# EAGLE design RCPCell (EAGLE 5.12)
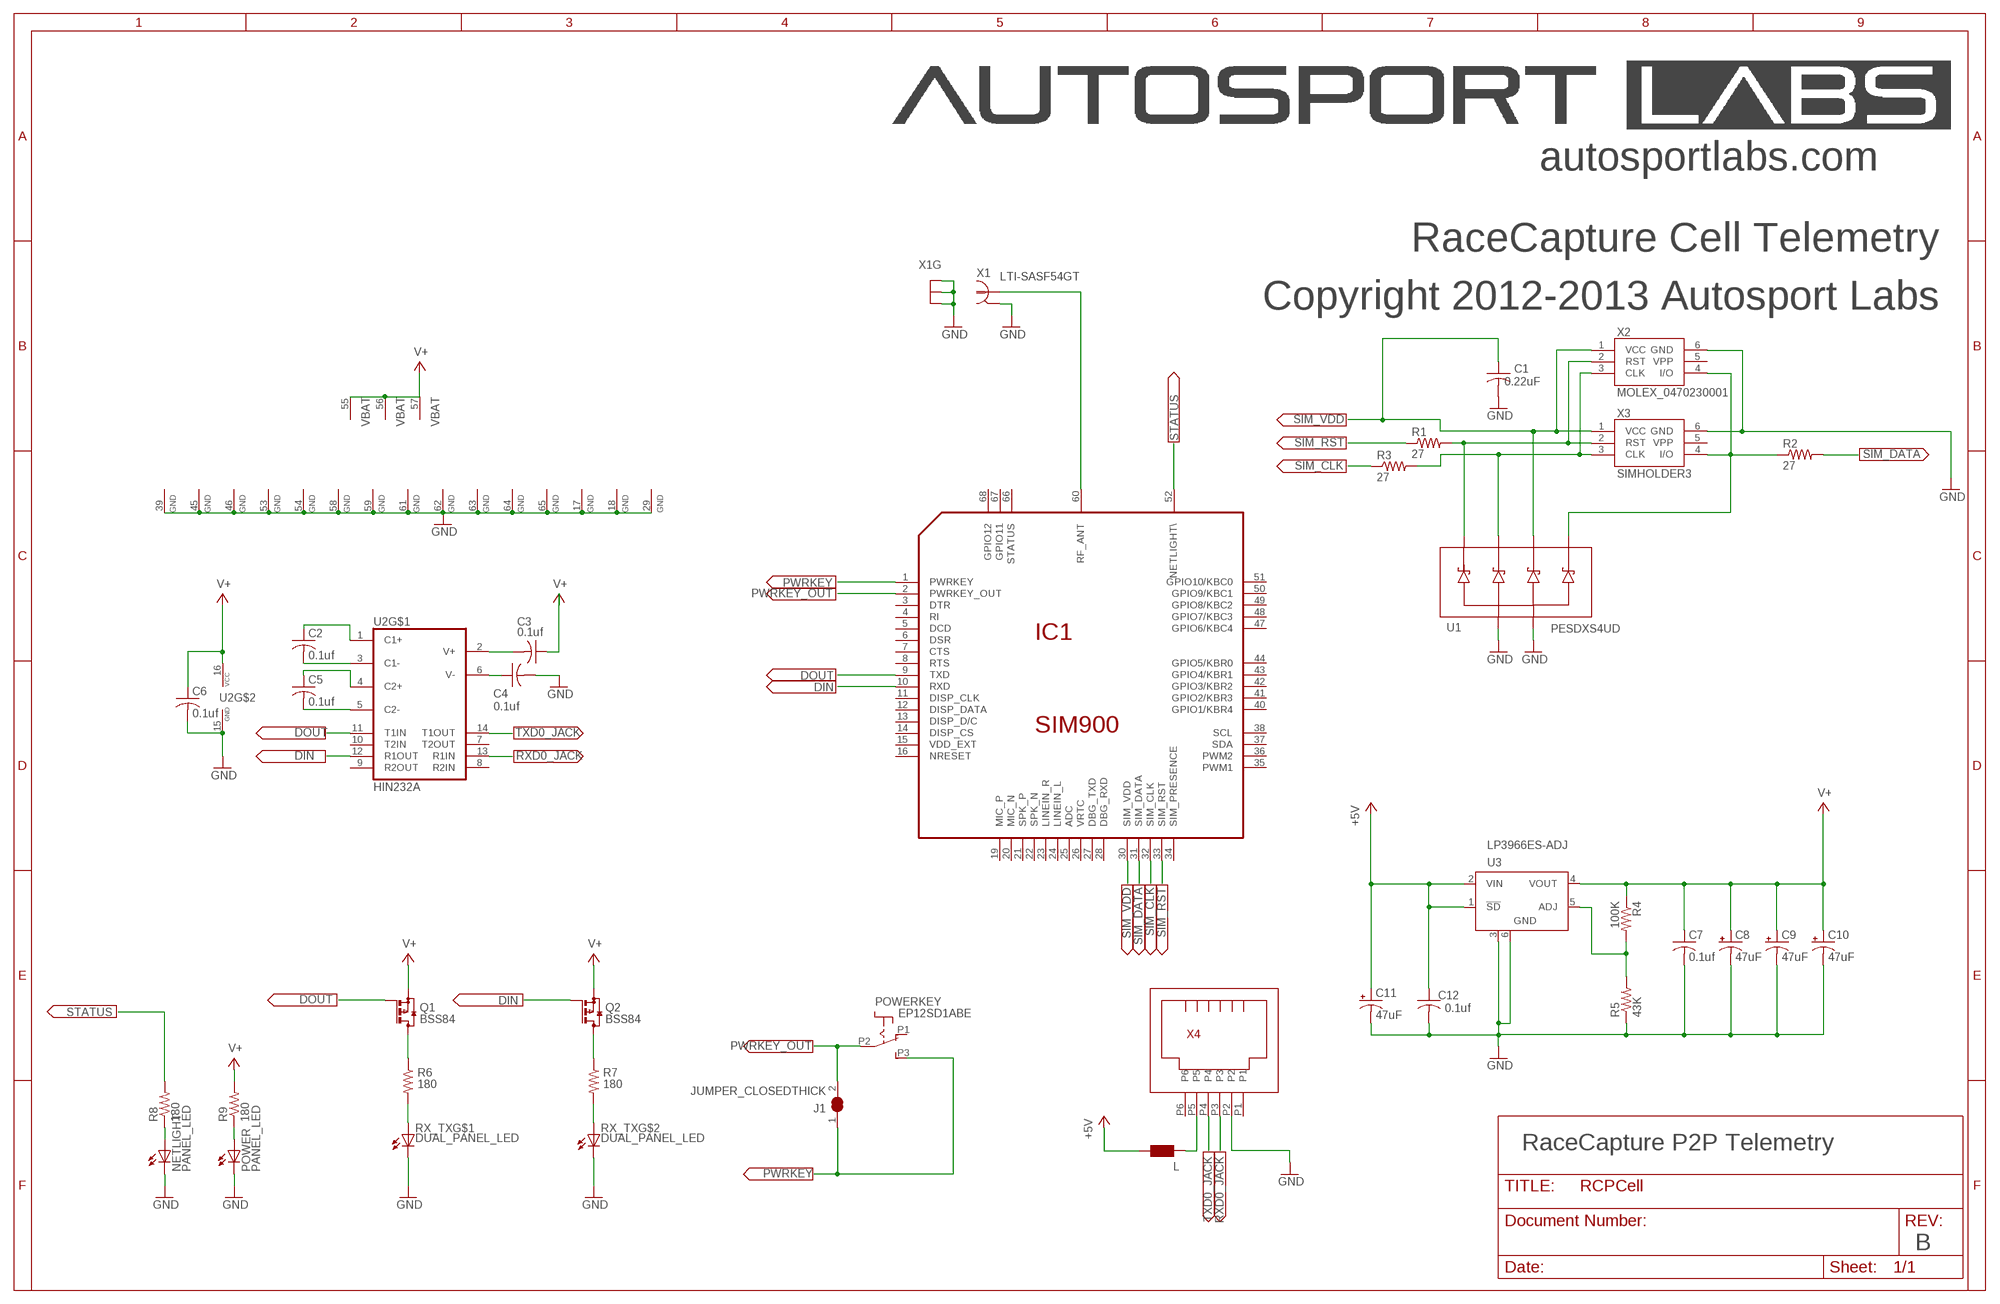
[diagram p0: schematic, sheet 1]

## Parts
C1  0.22uF  C-USC0603  [C0603]
C2  0.1uf  C-USC0603  [C0603]
C3  0.1uf  C-USC0603  [C0603]
C4  0.1uf  C-USC0603  [C0603]
C5  0.1uf  C-USC0603  [C0603]
C6  0.1uf  C-USC0603  [C0603]
C7  0.1uf  C-USC0603  [C0603]
C8  47uF  CPOL-USSMCD  [SMC_D]
C9  47uF  CPOL-USSMCD  [SMC_D]
C10  47uF  CPOL-USSMCD  [SMC_D]
C11  47uF  CPOL-USSMCD  [SMC_D]
C12  0.1uf  C-USC0603  [C0603]
IC1  SIM900  [SIM900]
J1  JUMPER_CLOSEDTHICK  [JUMPER_CLOSED_THICK]
L  WE-CBF_1812  [1812]
NETLIGHT  PANEL_LED  [RIGHTANGLE_CML_5323F5]
POWER  PANEL_LED  [RIGHTANGLE_CML_5323F5]
POWERKEY  EP12SD1ABE  [EP12SD1ABE]
Q1  BSS84  [SOT23]
Q2  BSS84  [SOT23]
R1  27  RESISTOR0603  [0603]
R2  27  RESISTOR0603  [0603]
R3  27  RESISTOR0603  [0603]
R4  100K  RESISTOR0603  [0603]
R5  43K  RESISTOR0603  [0603]
R6  180  R-US_R0603  [R0603]
R7  180  R-US_R0603  [R0603]
R8  180  RESISTOR0603  [0603]
R9  180  RESISTOR0603  [0603]
RX_TX  DUAL_PANEL_LED  [DUAL_PANEL_LED]
U1  PESDXS4UD  [SC-74]
U2  HIN232A  [SOIC-16]
U3  LP3966ES-ADJ  [TO263-5]
X1  LTI-SASF54GT  [LTI-SASF54GT]
X2  MOLEX_0470230001  [MOLEX_0470230001]
X3  SIMHOLDER3  [SIMHOLDER3]
X4  FCI_88400_066LF_RJ12_4POS  [RJ12_RIGHT_ANGLE_PCB]

## Nets
+5V: C11.+ C12.1 L.2 U3.1(!SD) U3.2(VIN)
DIN: IC1.10(RXD) Q2.1(G) U2.12(R1OUT)
DOUT: IC1.9(TXD) Q1.1(G) U2.11(T1IN)
GND: C1.2 C4.2 C6.2 C7.2 C8.- C9.- C10.- C11.- C12.2 IC1.17(GND) IC1.18(GND) IC1.29(GND) IC1.39(GND) IC1.45(GND) IC1.46(GND) IC1.53(GND) IC1.54(GND) IC1.58(GND) IC1.59(GND) IC1.61(GND) IC1.62(GND) IC1.63(GND) IC1.64(GND) IC1.65(GND) NETLIGHT.C POWER.C R5.1 RX_TX.2(C) RX_TX.4(C) U1.2 U1.5 U2.15(GND) U3.3(GND) U3.6(GND) X1.2(GND) X1.3(GND) X1.4(GND) X1.5(GND) X2.6(GND) X3.6(GND) X4.P2
N$1: L.1 X4.P5
N$2: NETLIGHT.A R8.1
N$3: Q2.3(D) R7.1
N$4: R6.2 RX_TX.1(A)
N$5: Q1.3(D) R6.1
N$6: R7.2 RX_TX.3(A)
N$7: R4.2 R5.2 U3.5(ADJ)
N$16: C2.1 U2.1(C1+)
N$17: C2.2 U2.3(C1-)
N$18: C5.1 U2.4(C2+)
N$19: C5.2 U2.5(C2-)
N$20: C3.2 U2.2(V+)
N$21: C4.1 U2.6(V-)
N$38: POWER.A R9.1
PWRKEY: IC1.1(PWRKEY) J1.1 POWERKEY.P3(S)
PWRKEY_OUT: IC1.2(PWRKEY_OUT) J1.2 POWERKEY.P2(P)
RF_ANT: IC1.60(RF_ANT) X1.1
RXD0_JACK: U2.13(R1IN) X4.P3
SIM_CLK: IC1.32(SIM_CLK) R3.1
SIM_CLK_CARD: R3.2 U1.3 X2.3(CLK) X3.3(CLK)
SIM_DATA: IC1.31(SIM_DATA) R2.2
SIM_DATA_CARD: R2.1 U1.6 X2.4(I/O) X3.4(I/O)
SIM_RST: IC1.33(SIM_RST) R1.1
SIM_RST_CARD: R1.2 U1.1 X2.2(RST) X3.2(RST)
SIM_VDD: C1.1 IC1.30(SIM_VDD) U1.4 X2.1(VCC) X3.1(VCC)
STATUS: IC1.52(NETLIGHT\) R8.2
TXD0_JACK: U2.14(T1OUT) X4.P4
V+ [vcc]: C3.1 C6.1 C7.1 C8.+ C9.+ C10.+ IC1.55(VBAT) IC1.56(VBAT) IC1.57(VBAT) Q1.2(S) Q2.2(S) R4.1 R9.2 U2.16(VCC) U3.4(VOUT)
Unconnected: IC1.3(DTR) IC1.4(RI) IC1.5(DCD) IC1.6(DSR) IC1.7(CTS) IC1.8(RTS) IC1.11(DISP_CLK) IC1.12(DISP_DATA) IC1.13(DISP_D/C) IC1.14(DISP_CS) IC1.15(VDD_EXT) IC1.16(NRESET) IC1.19(MIC_P) IC1.20(MIC_N) IC1.21(SPK_P) IC1.22(SPK_N) IC1.23(LINEIN_R) IC1.24(LINEIN_L) IC1.25(ADC) IC1.26(VRTC) IC1.27(DBG_TXD) IC1.28(DBG_RXD) IC1.34(SIM_PRESENCE) IC1.35(PWM1) IC1.36(PWM2) IC1.37(SDA) IC1.38(SCL) IC1.40(GPIO1/KBR4) IC1.41(GPIO2/KBR3) IC1.42(GPIO3/KBR2) IC1.43(GPIO4/KBR1) IC1.44(GPIO5/KBR0) IC1.47(GPIO6/KBC4) IC1.48(GPIO7/KBC3) IC1.49(GPIO8/KBC2) IC1.50(GPIO9/KBC1) IC1.51(GPIO10/KBC0) IC1.66(STATUS) IC1.67(GPIO11) IC1.68(GPIO12) POWERKEY.P1(O) U2.7(T2OUT) U2.8(R2IN) U2.9(R2OUT) U2.10(T2IN) X2.5(VPP) X3.5(VPP) X4.P1 X4.P6

## Notes on the sheet
- autosportlabs.com
- RaceCapture Cell Telemetry
- Copyright 2012-2013 Autosport Labs
- RaceCapture P2P Telemetry
- B

## Library data of the parts
C1-C7 C12 = rcl:C-US: CAPACITOR, American symbol
C8-C11 = rcl:CPOL-US: POLARIZED CAPACITOR, American symbol
IC1 = sim900:SIM900
J1 = jumpers:JUMPER_CLOSED
L = wuerth-elektronik:WE-CBF: SMD EMI Suppression Ferrite Beads - excellent anti-EMI properties - low DCR - impedances till 3000 ohms - rated current up to 6 A
NETLIGHT POWER = LEDs:PANEL_LED
POWERKEY = misc_switch:EP12SD1ABE
Q1 Q2 = transistor-small-signal:BSS84: P-CHANNEL MOS FET
R1-R5 R8 R9 = SparkFun:RESISTOR: Resistor Basic schematic elements and footprints for 0603, 1206, and PTH 1/10th watt (small) resistors.
R6 R7 = rcl:R-US_: RESISTOR, American symbol
RX_TX = LEDs:DUAL_PANEL_LED
U1 = smt_diodes:PESDXS4UD
U2 = max232:HIN232A
U3 = linear:LP3966?-ADJ: 3A Fast Ultra Low Dropout Linear Regulator Source: http://cache.national.com/ds/LP/LP3963.pdf
X1 = con-coax:LTI-SASF54GT: SMA vertical PCB thrue hole jack Source: Lighthorse Technologies, inc. SASF54GT.pdf
X2 = simcard:MOLEX_0470230001
X3 = SparkFun:SIMHOLDER3
X4 = FCI_RJ12:FCI_88400_066LF_RJ12_4POS

## Net classes
1 vcc: width 0.305 mm

## Board
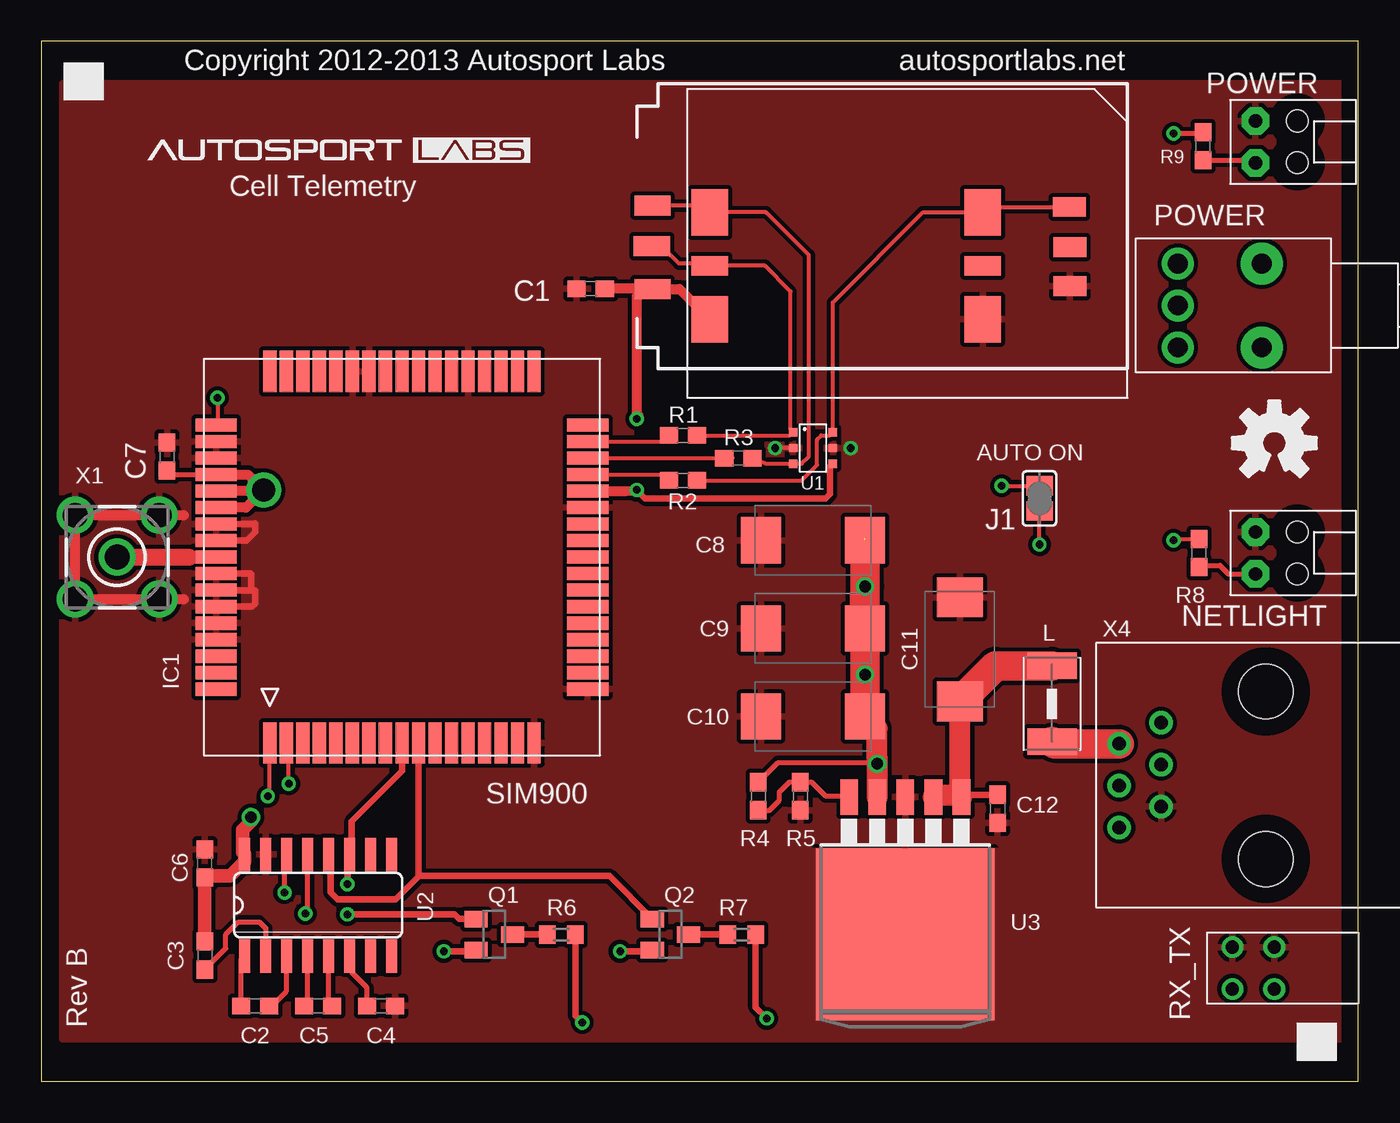
[diagram p1: board, top side]
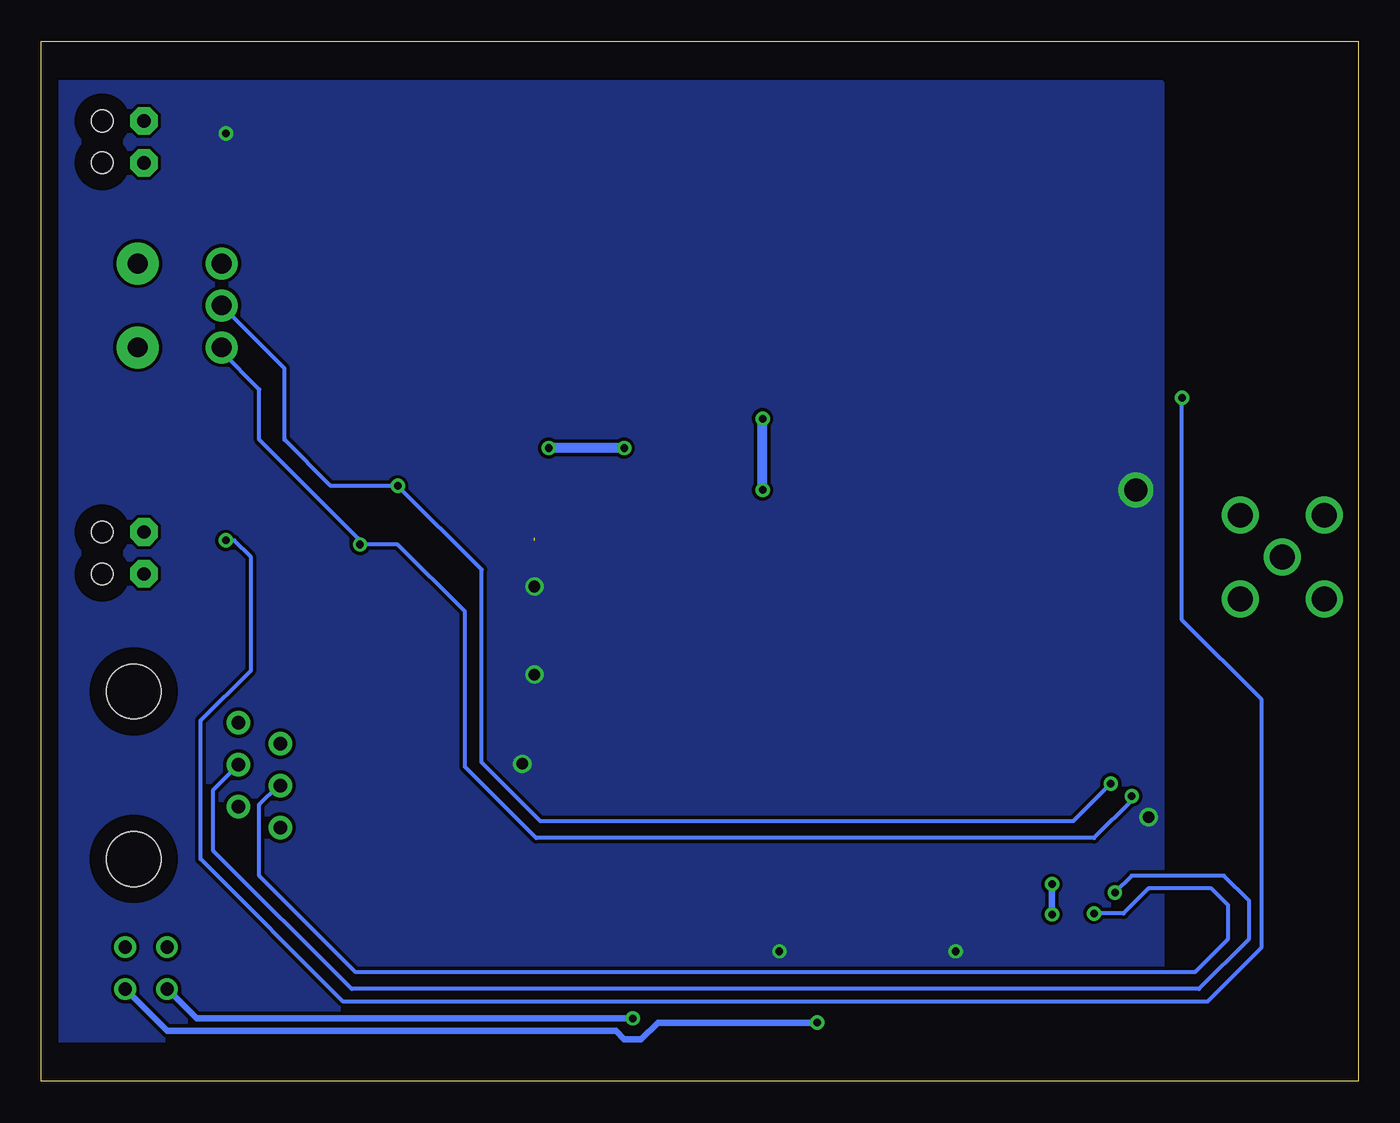
[diagram p2: board, bottom side, seen from below]

Size 79.76 x 62.99 mm. Coordinates in mm from the lower left corner, seen from the top.
Outline: 0,0 79.76,0 79.76,62.99 0,62.99 0,0
Copper layers (1*16): Top 0.035mm / dielectric 1.5mm / Bottom 0.035mm
Design rules "default *": minimum track width 8mil, minimum drill 16mil, track to track 8mil, track to pad 8mil, pad to pad 6mil, via to via 8mil, smd to smd 6mil, copper to edge 40mil, drill to drill 8mil, minimum pad ring 10mil, minimum via ring 8mil, stop-mask expansion 4mil, vias tented up to drill 19mil, thermal gap 10mil

### Footprints (pad centres in the part's own frame; a part is rotated, then mirrored left to right if it is on the bottom)
C0603 = smd 1.1 x 1: 1 -0.85,0; 2 0.85,0
SMC_D = smd 2.4 x 2.8: + -3.15,0; - 3.15,0
SIM900 = smd 2.5 x 0.8: 1 -11.25,8; 2 -11.25,7; 3 -11.25,6; 4 -11.25,5; 5 -11.25,4; 6 -11.25,3; 7 -11.25,2; 8 -11.25,1; 9 -11.25,0; 10 -11.25,-1; 11 -11.25,-2; 12 -11.25,-3; 13 -11.25,-4; 14 -11.25,-5; 15 -11.25,-6; 16 -11.25,-7; 17 -11.25,-8; 35 11.25,-8; 36 11.25,-7; 37 11.25,-6; 38 11.25,-5; 39 11.25,-4; 40 11.25,-3; 41 11.25,-2; 42 11.25,-1; 43 11.25,0; 44 11.25,1; 45 11.25,2; 46 11.25,3; 47 11.25,4; 48 11.25,5; 49 11.25,6; 50 11.25,7; 51 11.25,8 | smd 0.8 x 2.5: 18 -8,-11.25; 19 -7,-11.25; 20 -6,-11.25; 21 -5,-11.25; 22 -4,-11.25; 23 -3,-11.25; 24 -2,-11.25; 25 -1,-11.25; 26 0,-11.25; 27 1,-11.25; 28 2,-11.25; 29 3,-11.25; 30 4,-11.25; 31 5,-11.25; 32 6,-11.25; 33 7,-11.25; 34 8,-11.25; 52 8,11.25; 53 7,11.25; 54 6,11.25; 55 5,11.25; 56 4,11.25; 57 3,11.25; 58 2,11.25; 59 1,11.25; 60 0,11.25; 61 -1,11.25; 62 -2,11.25; 63 -3,11.25; 64 -4,11.25; 65 -5,11.25; 66 -6,11.25; 67 -7,11.25; 68 -8,11.25
JUMPER_CLOSED_THICK = smd 1.168 x 1.6: 1 -0.762,0; 2 0.762,0
1812 = smd 1.6 x 3: 1 -2.3,0; 2 2.3,0
RIGHTANGLE_CML_5323F5 = drill 0.8 pad 1.676 octagon: A -1.27,1.651; C 1.27,1.651 | hole 1.295: 1.27,-0.889; -1.27,-0.889
EP12SD1ABE = drill 1.194 pad 2.54 round: BRACKET1 -2.54,-5.08; BRACKET2 2.54,-5.08 | drill 1.194 pad 1.93 round: P1 2.54,0; P2 0,0; P3 -2.54,0
SOT23 = smd 1 x 1.4: 1 -0.95,-1.1; 2 0.95,-1.1; 3 0,1.1
0603 = smd 1.1 x 1: 1 -0.85,0; 2 0.85,0
R0603 = smd 1 x 1.1: 1 -0.85,0; 2 0.85,0
DUAL_PANEL_LED = drill 0.8 round: 1 -1.27,5.08; 2 1.27,5.08; 3 -1.27,7.62; 4 1.27,7.62
SC-74 = smd 0.5 x 0.5: 1 -0.95,-1.2; 2 0,-1.2; 3 0.95,-1.2; 4 0.95,1.2; 5 0,1.2; 6 -0.95,1.2
SOIC-16 = smd 0.66 x 2.032: 1 -4.445,-3.073; 2 -3.175,-3.073; 3 -1.905,-3.073; 4 -0.635,-3.073; 5 0.635,-3.073; 6 1.905,-3.073; 7 3.175,-3.073; 8 4.445,-3.073; 9 4.445,3.073; 10 3.175,3.073; 11 1.905,3.073; 12 0.635,3.073; 13 -0.635,3.073; 14 -1.905,3.073; 15 -3.175,3.073; 16 -4.445,3.073
TO263-5 = smd 1.067 x 2.159: 1 -3.404,-5.791; 2 -1.702,-5.791; 3 0,-5.791; 4 1.702,-5.791; 5 3.404,-5.791 | smd 10.8 x 10.41: 6 0,2.54
LTI-SASF54GT = drill 1.5 pad 2.2 round: 1 0,0; 2 -2.54,2.54; 3 2.54,2.54; 4 2.54,-2.54; 5 -2.54,-2.54
MOLEX_0470230001 = smd 2.2 x 2.8: 1 1.36,4.75; 3 1.36,11.23; 4 17.9,11.23; 6 17.9,4.75 | smd 2.2 x 1.2: 2 1.36,7.99; 5 17.9,7.99
SIMHOLDER3 = smd 2.2 x 1.2: 1 0.95,4.81; 2 0.91,7.41; 3 0.95,9.86 | smd 2 x 1.2: 4 26.2,9.78; 5 26.22,7.34; 6 26.22,4.98
RJ12_RIGHT_ANGLE_PCB = drill 0.8 pad 1.422 round: P1 -3.175,8.89; P2 -1.905,6.35; P3 -0.635,8.89; P4 0.635,6.35; P5 1.905,8.89; P6 3.175,6.35 | hole 3.302: -5.08,0; 5.08,0

### Placement (x,y rotation side)
C1  33.27,48.01 180 top
C2  12.95,4.57 0 top
C3  9.91,7.62 270 top
C4  20.57,4.57 0 top
C5  16.76,4.57 0 top
C6  9.91,13.21 90 top
C7  7.62,37.85 90 top
C8  46.74,32.77 180 top
C9  46.74,27.43 180 top
C10  46.74,22.1 180 top
C11  55.63,26.16 90 top
C12  57.91,16.51 270 top
IC1  21.84,31.75 90 top
J1  60.45,35.31 90 top
L  61.21,22.86 90 top
NETLIGHT  75.18,32 90 top
POWER  75.18,56.9 90 top
POWERKEY  68.83,46.99 90 top
Q1  27.43,8.89 270 top
Q2  38.1,8.89 270 top
R1  38.86,39.12 0 top
R2  38.86,36.4 180 top
R3  42.21,37.74 0 top
R4  43.43,17.27 270 top
R5  45.97,17.27 90 top
R6  31.5,8.89 0 top
R7  42.42,8.89 0 top
R8  70.1,32 90 top
R9  70.36,56.64 90 top
RX_TX  79.76,6.86 90 top
U1  46.74,38.35 270 top
U2  16.76,10.67 0 top
U3  52.32,11.43 180 top
X1  4.6,31.75 0 top
X2  39.12,41.4 0 top
X3  36.07,43.18 0 top
X4  74.17,18.54 90 top

### Tracks (layer width: path | path; a pad name or v marks a point on that pad's centre or on a via)
+5V
  Top 0.305: 55.87,17.36 55.63,17.6 | 55.63,20.07 55.73,19.96
  Top 0.406: C12.1 55.87,17.36 U3.1
  Top 1.27: 55.63,17.32 55.63,20.07 C11.+ | U3.1 55.63,17.32 | 55.63,17.32 54.13,17.32 U3.2
  Top 1.778: L.2 57.77,25.16 C11.+
DIN
  Top 0.406: U2.12 17.53,13.61 17.53,11.43 17.93,11.02 21.47,11.02 22.86,12.41 22.84,12.43 | 22.84,12.43 IC1.10 | 22.84,12.43 34.41,12.43 Q2.1
DOUT  (via drill 0.46)
  Top 0.406: IC1.9 21.84,18.8 18.8,15.75 18.8,13.87 U2.11 18.54,13.61 v18.54,11.94 | Q1.1 25.31,9.84 25.04,10.11 v18.54,10.11
  Bottom 0.406: v18.54,10.11 v18.54,11.94
GND  (via drill 0.46)
  Top 0.254: U1.2 v44.45,38.35
  Top 0.406: IC1.58 12.92,33.75 12.95,33.78 12.95,33.27 12.45,32.77 10.61,32.77 IC1.59 | IC1.63 12.75,28.75 12.95,28.96 12.95,29.72 12.7,29.72 | 12.7,29.72 10.63,29.72 IC1.62 | IC1.61 12.68,30.75 12.7,30.73 12.7,29.72
  Top 0.61: 8.64,29.21 X1.4 X1.5 X1.2 X1.3 8.64,34.29
  Bottom 0.61: v44.45,38.35 v49.02,38.35
  pour Top (isolate 0.254): 78.74,60.45 78.74,2.54 1.27,2.54 1.27,60.45
  pour Top (no thermals): 45.97,13.97 58.93,13.97 58.93,2.54 45.97,2.54
N$1
  Top 1.778: L.1 61.21,20.57 61.34,20.45 X4.P5
N$2
  Top 0.305: R8.1 70.19,31.24 71.37,31.24 71.88,30.73 NETLIGHT.A
N$3
  Top 0.406: Q2.3 R7.1
N$4  (via drill 0.46)
  Top 0.406: R6.2 32.35,3.98 v32.77,3.56
  Bottom 0.406: v32.77,3.56 42.42,3.56 43.43,2.54 44.45,2.54 44.96,3.05 72.14,3.05 RX_TX.1
N$5
  Top 0.406: Q1.3 R6.1
N$6  (via drill 0.46)
  Top 0.406: R7.2 43.27,4.48 v43.94,3.81
  Bottom 0.406: v43.94,3.81 70.36,3.81 RX_TX.3
N$7
  Top 0.305: U3.5 48.87,17.27 47.5,17.27 46.65,18.12 R5.2 45.3,18.12 44.7,17.53 44.7,17.02 44.11,16.42 R4.2
N$16
  Top 0.305: C2.1 12.1,7.38 U2.1
N$17
  Top 0.305: C2.2 13.97,4.57 14.86,5.46 U2.3
N$18
  Top 0.305: C5.1 16.13,4.79 U2.4
N$19
  Top 0.305: C5.2 17.4,4.79 U2.5
N$20
  Top 0.305: U2.2 13.59,9.27 13.21,9.65 11.94,9.65 11.18,8.89 11.18,8.04 C3.2
N$21
  Top 0.305: C4.1 19.72,5.68 18.8,6.6 18.8,7.47 U2.6
N$38
  Top 0.305: POWER.A 73.37,55.79 R9.1
PWRKEY  (via drill 0.46)
  Top 0.254: IC1.1 13.84,17.4 v13.72,17.27 | v60.45,32.51 J1.1
  Bottom 0.254: POWERKEY.P3 68.83,44.2 66.55,41.91 66.55,38.86 60.45,32.77 v60.45,32.51 58.17,32.51 54.1,28.45 54.1,19.05 49.78,14.73 16,14.73 13.72,17.02 v13.72,17.27
PWRKEY_OUT  (via drill 0.46)
  Top 0.254: IC1.2 14.99,20.36 v14.99,18.03 | v58.17,36.07 J1.2
  Bottom 0.254: v14.99,18.03 17.27,15.75 49.53,15.75 53.09,19.3 53.09,30.99 v58.17,36.07 62.23,36.07 65.02,38.86 65.02,43.18 POWERKEY.P2
RF_ANT
  Top 0.787: 8.94,31.75 IC1.60
  Top 1.016: X1.1 8.94,31.75
RXD0_JACK  (via drill 0.46)
  Top 0.305: v16,10.16 16.13,10.29 U2.13
  Bottom 0.254: v16,10.16 14.22,10.16 12.7,11.68 8.89,11.68 7.87,10.67 7.87,8.64 9.91,6.6 60.71,6.6 66.55,12.45 66.55,16.76 65.41,17.91 X4.P3
SIM_CLK
  Top 0.254: IC1.32 41.87,37.75 R3.1
SIM_CLK_CARD
  Top 0.254: 37.06,53.09 X3.3 40.07,53.04 X2.3 43.89,52.63 46.48,50.04 46.48,37.85 46.04,37.4 U1.3 43.91,37.4 R3.2
SIM_DATA
  Top 0.254: IC1.31 37.66,36.75 R2.2
SIM_DATA_CARD
  Top 0.254: 62.14,53.09 X3.4 57.34,52.96 X2.4 53.39,52.63 47.94,47.17 U1.6 47.75,39.12 47.24,39.12 46.99,38.86 46.99,37.34 46.05,36.4 R2.1
SIM_RST
  Top 0.254: IC1.33 37.65,38.75 R1.1
SIM_RST_CARD
  Top 0.254: X3.2 37.55,50.59 38.61,49.53 40.34,49.53 X2.2 43.83,49.39 45.38,47.84 45.38,39.46 U1.1 45.35,39.12 R1.2
SIM_VDD  (via drill 0.46)
  Top 0.254: 36.07,47.55 X3.1 | v36.07,40.13 36.32,40.39
  Top 0.406: v36.07,35.81 36.58,35.31 47.5,35.31 47.75,35.56 47.75,37.22 U1.4 | X3.1 37,48.01
  Top 0.61: v36.07,40.13 36.07,47.55 | v36.07,35.81 35.37,35.75 IC1.30 | 37,48.01 C1.1 | X2.1 38.64,47.99 X3.1
  Bottom 0.61: v36.07,35.81 v36.07,40.13
STATUS  (via drill 0.46)
  Top 0.254: v68.58,32.77 68.67,32.85 R8.2 | v10.67,41.4 10.67,39.82 IC1.52
  Bottom 0.254: v68.58,32.77 68.07,32.77 67.06,31.75 67.06,24.89 70.1,21.84 70.1,13.46 61.47,4.83 9.14,4.83 5.84,8.13 5.84,23.11 10.67,27.94 v10.67,41.4
TXD0_JACK  (via drill 0.46)
  Top 0.305: v14.73,11.43 14.73,13.61 U2.14
  Bottom 0.254: v14.73,11.43 13.72,12.45 8.13,12.45 6.6,10.92 6.6,8.64 9.65,5.59 60.96,5.59 69.34,13.97 69.34,17.65 X4.P4
V+  (via drill 0.46, 0.7, 1.4)  (1 unrouted)
  Top 0.305: 50.62,19.56 50.37,19.3 44.62,19.3 R4.1 | R9.2 70.27,57.4 v68.58,57.4 | C9.+ 49.78,27.53 | IC1.55 7.87,36.75 C7.1
  Top 0.406: v24.38,7.87 26.27,7.87 Q1.2 | v35.05,7.87 36.93,7.87 Q2.2
  Top 0.61: IC1.55 12.53,36.75 v13.46,35.81 12.4,34.75 IC1.57 | 13.4,35.75 IC1.56
  Top 0.813: v13.46,35.81 13.4,35.75 | v12.7,16 12.7,15.75 12.19,15.24 12.19,13.87 U2.16 12.32,13.34 11.43,12.45 9.99,12.45 C6.1 C3.1
  Top 1.27: U3.4 50.62,19.56 50.62,21.36 C10.+
  Top 1.778: C8.+ C9.+ C10.+ | 49.78,27.53 v49.89,29.97 | 49.89,32.92 49.86,32.89
  other vias: 50.62,19.23 49.89,24.64
  pour Bottom: 11.94,60.45 78.74,60.45 78.74,2.54 11.94,2.54

### Text on the board
tPlace: Copyright 2012-2013 Autosport Labs | autosportlabs.net | Cell Telemetry | POWER | AUTO ON | Rev B